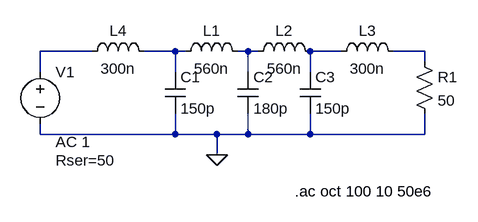
[diagram p0: schematic Draft2.asc]
Draft2.asc, the LTspice schematic file:
Version 4
SHEET 1 880 680
WIRE 48 128 -32 128
WIRE 176 128 128 128
WIRE 192 128 176 128
WIRE 288 128 272 128
WIRE 304 128 288 128
WIRE 432 128 384 128
WIRE 560 128 512 128
WIRE 560 144 560 128
WIRE -32 160 -32 128
WIRE 176 160 176 128
WIRE 288 160 288 128
WIRE 384 160 384 128
WIRE -32 256 -32 240
WIRE 176 256 176 224
WIRE 176 256 -32 256
WIRE 240 256 176 256
WIRE 288 256 288 224
WIRE 288 256 240 256
WIRE 384 256 384 224
WIRE 384 256 288 256
WIRE 560 256 560 224
WIRE 560 256 384 256
WIRE 240 288 240 256
FLAG 240 288 0
SYMBOL cap 160 160 R0
SYMATTR InstName C1
SYMATTR Value 150p
SYMBOL cap 272 160 R0
SYMATTR InstName C2
SYMATTR Value 180p
SYMBOL cap 368 160 R0
SYMATTR InstName C3
SYMATTR Value 150p
SYMBOL ind 176 144 R270
WINDOW 0 32 56 VTop 2
WINDOW 3 5 56 VBottom 2
SYMATTR InstName L1
SYMATTR Value 560n
SYMBOL ind 288 144 R270
WINDOW 0 32 56 VTop 2
WINDOW 3 5 56 VBottom 2
SYMATTR InstName L2
SYMATTR Value 560n
SYMBOL ind 416 144 R270
WINDOW 0 32 56 VTop 2
WINDOW 3 5 56 VBottom 2
SYMATTR InstName L3
SYMATTR Value 300n
SYMBOL ind 32 144 R270
WINDOW 0 32 56 VTop 2
WINDOW 3 5 56 VBottom 2
SYMATTR InstName L4
SYMATTR Value 300n
SYMBOL res 544 128 R0
SYMATTR InstName R1
SYMATTR Value 50
SYMBOL voltage -32 144 R0
WINDOW 123 24 124 Left 2
WINDOW 39 24 152 Left 2
SYMATTR InstName V1
SYMATTR Value ""
SYMATTR Value2 AC 1
SYMATTR SpiceLine Rser=50
TEXT 360 344 Left 2 !.ac oct 100 10 50e6

The netlist it stands for:
* Draft2.asc
C1 N002 0 150p
C2 N003 0 180p
C3 N004 0 150p
L1 N002 N003 560n
L2 N003 N004 560n
L3 N004 N005 300n
L4 N001 N002 300n
R1 N005 0 50
V1 N001 0 AC 1 Rser=50
.ac oct 100 10 50e6
.backanno
.end